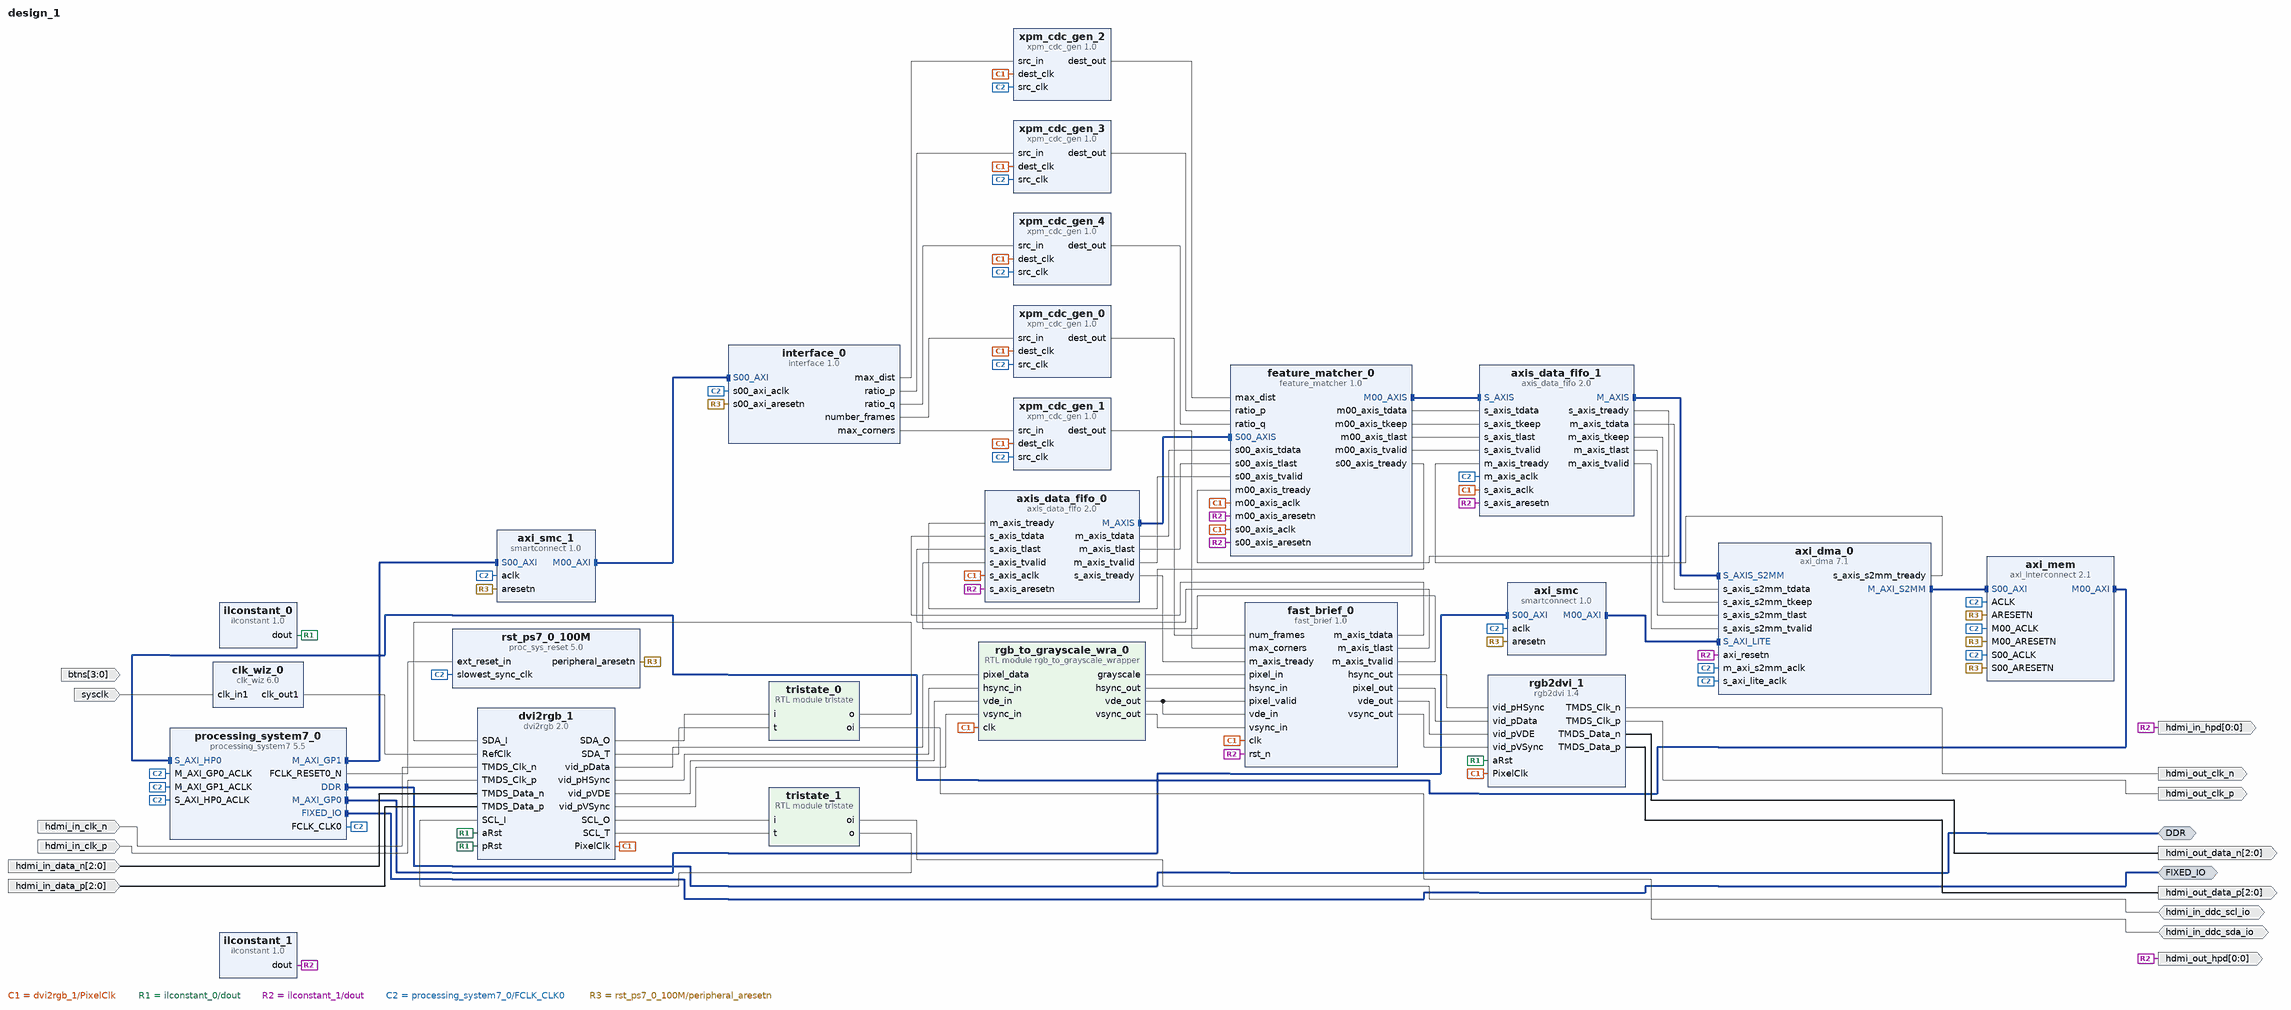
[diagram p0: block diagram of the top level]
# Vivado block design design_1, xc7z020clg400-1, Vivado 2025.1
create_bd_design design_1

create_bd_intf_port -mode Master -vlnv xilinx.com:interface:ddrx_rtl:1.0 DDR
create_bd_intf_port -mode Master -vlnv xilinx.com:display_processing_system7:fixedio_rtl:1.0 FIXED_IO
create_bd_port -dir I hdmi_in_clk_p
create_bd_port -dir I hdmi_in_clk_n
create_bd_port -dir I -from 2 -to 0 hdmi_in_data_n
create_bd_port -dir I -from 2 -to 0 hdmi_in_data_p
create_bd_port -dir I sysclk
create_bd_port -dir I -from 3 -to 0 btns
create_bd_port -dir O hdmi_out_clk_p
create_bd_port -dir O hdmi_out_clk_n
create_bd_port -dir O -from 2 -to 0 hdmi_out_data_p
create_bd_port -dir O -from 2 -to 0 hdmi_out_data_n
create_bd_port -dir O -from 0 -to 0 hdmi_in_hpd
create_bd_port -dir O -from 0 -to 0 hdmi_out_hpd
create_bd_port -dir IO hdmi_in_ddc_scl_io
create_bd_port -dir IO hdmi_in_ddc_sda_io

create_bd_cell -type ip -vlnv xilinx.com:ip:processing_system7:5.5 processing_system7_0
set_property -dict [list \
  CONFIG.PCW_APU_PERIPHERAL_FREQMHZ 650 \
  CONFIG.PCW_CRYSTAL_PERIPHERAL_FREQMHZ 50 \
  CONFIG.PCW_ENET0_PERIPHERAL_ENABLE 0 \
  CONFIG.PCW_FCLK_CLK0_BUF FALSE \
  CONFIG.PCW_FPGA0_PERIPHERAL_FREQMHZ 100 \
  CONFIG.PCW_FPGA1_PERIPHERAL_FREQMHZ 50 \
  CONFIG.PCW_GPIO_MIO_GPIO_ENABLE 1 \
  CONFIG.PCW_GPIO_MIO_GPIO_IO MIO \
  CONFIG.PCW_I2C_RESET_ENABLE 1 \
  CONFIG.PCW_IRQ_F2P_INTR 1 \
  CONFIG.PCW_PERIPHERAL_BOARD_PRESET part0 \
  CONFIG.PCW_PRESET_BANK1_VOLTAGE {LVCMOS 1.8V} \
  CONFIG.PCW_QSPI_PERIPHERAL_ENABLE 0 \
  CONFIG.PCW_SD0_PERIPHERAL_ENABLE 0 \
  CONFIG.PCW_UART1_PERIPHERAL_ENABLE 0 \
  CONFIG.PCW_UIPARAM_DDR_BUS_WIDTH {16 Bit} \
  CONFIG.PCW_UIPARAM_DDR_FREQ_MHZ 525 \
  CONFIG.PCW_UIPARAM_DDR_PARTNO {MT41J256M16 RE-125} \
  CONFIG.PCW_USB0_PERIPHERAL_ENABLE 0 \
  CONFIG.PCW_USB_RESET_ENABLE 1 \
  CONFIG.PCW_USE_FABRIC_INTERRUPT 1 \
  CONFIG.PCW_USE_M_AXI_GP1 1 \
  CONFIG.PCW_USE_S_AXI_HP0 1 \
  CONFIG.preset None \
] [get_bd_cells processing_system7_0]
# 489 more settings of processing_system7_0 are not shown: defaults, MIO pin electricals, DDR timing, and values the tool derives
create_bd_cell -type ip -vlnv xilinx.com:ip:clk_wiz:6.0 clk_wiz_0
set_property -dict [list \
  CONFIG.CLKIN1_JITTER_PS 80.0 \
  CONFIG.CLKOUT1_DRIVES BUFG \
  CONFIG.CLKOUT1_JITTER 109.241 \
  CONFIG.CLKOUT1_PHASE_ERROR 96.948 \
  CONFIG.CLKOUT1_REQUESTED_OUT_FREQ 200.000 \
  CONFIG.CLKOUT2_DRIVES BUFG \
  CONFIG.CLKOUT3_DRIVES BUFG \
  CONFIG.CLKOUT4_DRIVES BUFG \
  CONFIG.CLKOUT5_DRIVES BUFG \
  CONFIG.CLKOUT6_DRIVES BUFG \
  CONFIG.CLKOUT7_DRIVES BUFG \
  CONFIG.MMCM_BANDWIDTH OPTIMIZED \
  CONFIG.MMCM_CLKFBOUT_MULT_F 8 \
  CONFIG.MMCM_CLKIN1_PERIOD 8.000 \
  CONFIG.MMCM_CLKIN2_PERIOD 10.0 \
  CONFIG.MMCM_CLKOUT0_DIVIDE_F 5 \
  CONFIG.MMCM_COMPENSATION ZHOLD \
  CONFIG.MMCM_DIVCLK_DIVIDE 1 \
  CONFIG.PLL_CLKIN_PERIOD 8.000 \
  CONFIG.PRIMITIVE PLL \
  CONFIG.PRIM_IN_FREQ 125.000 \
  CONFIG.USE_LOCKED false \
  CONFIG.USE_RESET false \
] [get_bd_cells clk_wiz_0]
create_bd_cell -type module -reference tristate tristate_0
create_bd_cell -type module -reference tristate tristate_1
create_bd_cell -type inline_hdl -vlnv xilinx.com:inline_hdl:ilconstant:1.0 ilconstant_0
set_property -dict {CONFIG.CONST_VAL 0} [get_bd_cells ilconstant_0]
create_bd_cell -type inline_hdl -vlnv xilinx.com:inline_hdl:ilconstant:1.0 ilconstant_1
create_bd_cell -type module -reference rgb_to_grayscale_wrapper rgb_to_grayscale_wra_0
create_bd_cell -type ip -vlnv mit.edu:user:fast_brief:1.0 fast_brief_0
create_bd_cell -type ip -vlnv mit.edu:user:feature_matcher:1.0 feature_matcher_0
set_property -dict {CONFIG.IDX_SIZE 11 CONFIG.NUM_CORNERS 1024} [get_bd_cells feature_matcher_0]
create_bd_cell -type ip -vlnv xilinx.com:ip:axis_data_fifo:2.0 axis_data_fifo_0
set_property -dict {CONFIG.FIFO_DEPTH 4096 CONFIG.HAS_TLAST 1 CONFIG.TDATA_NUM_BYTES 35} [get_bd_cells axis_data_fifo_0]
create_bd_cell -type ip -vlnv xilinx.com:ip:axi_dma:7.1 axi_dma_0
set_property -dict [list \
  CONFIG.c_include_mm2s 0 \
  CONFIG.c_include_s2mm_dre 0 \
  CONFIG.c_include_sg 0 \
  CONFIG.c_micro_dma 0 \
  CONFIG.c_s_axis_s2mm_tdata_width 64 \
  CONFIG.c_sg_length_width 23 \
] [get_bd_cells axi_dma_0]
create_bd_cell -type ip -vlnv xilinx.com:ip:axi_interconnect:2.1 axi_mem
set_property -dict {CONFIG.NUM_MI 1} [get_bd_cells axi_mem]
create_bd_cell -type ip -vlnv xilinx.com:ip:proc_sys_reset:5.0 rst_ps7_0_100M
create_bd_cell -type ip -vlnv xilinx.com:ip:axis_data_fifo:2.0 axis_data_fifo_1
set_property -dict [list \
  CONFIG.FIFO_DEPTH 64 \
  CONFIG.HAS_TKEEP 1 \
  CONFIG.IS_ACLK_ASYNC 1 \
  CONFIG.TDATA_NUM_BYTES 8 \
] [get_bd_cells axis_data_fifo_1]
create_bd_cell -type ip -vlnv xilinx.com:ip:smartconnect:1.0 axi_smc
set_property -dict {CONFIG.NUM_SI 1} [get_bd_cells axi_smc]
create_bd_cell -type ip -vlnv digilentinc.com:ip:dvi2rgb:2.0 dvi2rgb_1
set_property -dict {CONFIG.kClkRange 3} [get_bd_cells dvi2rgb_1]
create_bd_cell -type ip -vlnv digilentinc.com:ip:rgb2dvi:1.4 rgb2dvi_1
set_property -dict {CONFIG.kClkPrimitive MMCM CONFIG.kClkRange 2} [get_bd_cells rgb2dvi_1]
create_bd_cell -type ip -vlnv xilinx.com:ip:xpm_cdc_gen:1.0 xpm_cdc_gen_0
set_property -dict {CONFIG.CDC_TYPE xpm_cdc_array_single CONFIG.WIDTH 8} [get_bd_cells xpm_cdc_gen_0]
create_bd_cell -type ip -vlnv user.org:user:interface:1.0 interface_0
create_bd_cell -type ip -vlnv xilinx.com:ip:xpm_cdc_gen:1.0 xpm_cdc_gen_1
set_property -dict {CONFIG.CDC_TYPE xpm_cdc_array_single CONFIG.WIDTH 16} [get_bd_cells xpm_cdc_gen_1]
create_bd_cell -type ip -vlnv xilinx.com:ip:xpm_cdc_gen:1.0 xpm_cdc_gen_2
set_property -dict {CONFIG.CDC_TYPE xpm_cdc_array_single CONFIG.WIDTH 16} [get_bd_cells xpm_cdc_gen_2]
create_bd_cell -type ip -vlnv xilinx.com:ip:xpm_cdc_gen:1.0 xpm_cdc_gen_3
set_property -dict {CONFIG.CDC_TYPE xpm_cdc_array_single CONFIG.WIDTH 16} [get_bd_cells xpm_cdc_gen_3]
create_bd_cell -type ip -vlnv xilinx.com:ip:xpm_cdc_gen:1.0 xpm_cdc_gen_4
set_property -dict {CONFIG.CDC_TYPE xpm_cdc_array_single CONFIG.WIDTH 16} [get_bd_cells xpm_cdc_gen_4]
create_bd_cell -type ip -vlnv xilinx.com:ip:smartconnect:1.0 axi_smc_1
set_property -dict {CONFIG.NUM_SI 1} [get_bd_cells axi_smc_1]

# ---- connections ----

connect_bd_intf_net [get_bd_intf_pins axi_dma_0/M_AXI_S2MM] [get_bd_intf_pins axi_mem/S00_AXI]
connect_bd_intf_net -intf_net axi_mem_intercon_M00_AXI [get_bd_intf_pins axi_mem/M00_AXI] [get_bd_intf_pins processing_system7_0/S_AXI_HP0]
connect_bd_intf_net [get_bd_intf_pins axi_smc_1/M00_AXI] [get_bd_intf_pins interface_0/S00_AXI]
connect_bd_intf_net [get_bd_intf_pins axi_smc/M00_AXI] [get_bd_intf_pins axi_dma_0/S_AXI_LITE]
connect_bd_intf_net [get_bd_intf_pins axis_data_fifo_0/M_AXIS] [get_bd_intf_pins feature_matcher_0/S00_AXIS]
connect_bd_intf_net [get_bd_intf_pins axis_data_fifo_1/M_AXIS] [get_bd_intf_pins axi_dma_0/S_AXIS_S2MM]
connect_bd_intf_net [get_bd_intf_pins feature_matcher_0/M00_AXIS] [get_bd_intf_pins axis_data_fifo_1/S_AXIS]
connect_bd_intf_net [get_bd_intf_ports DDR] [get_bd_intf_pins processing_system7_0/DDR]
connect_bd_intf_net [get_bd_intf_ports FIXED_IO] [get_bd_intf_pins processing_system7_0/FIXED_IO]
connect_bd_intf_net [get_bd_intf_pins processing_system7_0/M_AXI_GP0] [get_bd_intf_pins axi_smc/S00_AXI]
connect_bd_intf_net [get_bd_intf_pins processing_system7_0/M_AXI_GP1] [get_bd_intf_pins axi_smc_1/S00_AXI]
connect_bd_net [get_bd_ports hdmi_in_ddc_scl_io] [get_bd_pins tristate_1/oi]
connect_bd_net [get_bd_ports hdmi_in_ddc_sda_io] [get_bd_pins tristate_0/oi]
connect_bd_net [get_bd_pins axi_dma_0/s_axis_s2mm_tready] [get_bd_pins axis_data_fifo_1/m_axis_tready]
connect_bd_net [get_bd_pins axis_data_fifo_0/m_axis_tdata] [get_bd_pins feature_matcher_0/s00_axis_tdata]
connect_bd_net [get_bd_pins axis_data_fifo_0/m_axis_tlast] [get_bd_pins feature_matcher_0/s00_axis_tlast]
connect_bd_net [get_bd_pins axis_data_fifo_0/m_axis_tvalid] [get_bd_pins feature_matcher_0/s00_axis_tvalid]
connect_bd_net [get_bd_pins axis_data_fifo_0/s_axis_tready] [get_bd_pins fast_brief_0/m_axis_tready]
connect_bd_net [get_bd_pins axis_data_fifo_1/m_axis_tdata] [get_bd_pins axi_dma_0/s_axis_s2mm_tdata]
connect_bd_net [get_bd_pins axis_data_fifo_1/m_axis_tkeep] [get_bd_pins axi_dma_0/s_axis_s2mm_tkeep]
connect_bd_net [get_bd_pins axis_data_fifo_1/m_axis_tlast] [get_bd_pins axi_dma_0/s_axis_s2mm_tlast]
connect_bd_net [get_bd_pins axis_data_fifo_1/m_axis_tvalid] [get_bd_pins axi_dma_0/s_axis_s2mm_tvalid]
connect_bd_net [get_bd_pins axis_data_fifo_1/s_axis_tready] [get_bd_pins feature_matcher_0/m00_axis_tready]
connect_bd_net [get_bd_pins clk_wiz_0/clk_out1] [get_bd_pins dvi2rgb_1/RefClk]
connect_bd_net [get_bd_pins dvi2rgb_1/PixelClk] \
  [get_bd_pins rgb_to_grayscale_wra_0/clk] [get_bd_pins axis_data_fifo_0/s_axis_aclk] \
  [get_bd_pins axis_data_fifo_1/s_axis_aclk] [get_bd_pins rgb2dvi_1/PixelClk] [get_bd_pins xpm_cdc_gen_0/dest_clk] \
  [get_bd_pins feature_matcher_0/s00_axis_aclk] [get_bd_pins feature_matcher_0/m00_axis_aclk] \
  [get_bd_pins xpm_cdc_gen_1/dest_clk] [get_bd_pins xpm_cdc_gen_2/dest_clk] [get_bd_pins xpm_cdc_gen_3/dest_clk] \
  [get_bd_pins xpm_cdc_gen_4/dest_clk] [get_bd_pins fast_brief_0/clk]
connect_bd_net [get_bd_pins dvi2rgb_1/SCL_O] [get_bd_pins tristate_1/i]
connect_bd_net [get_bd_pins dvi2rgb_1/SCL_T] [get_bd_pins tristate_1/t]
connect_bd_net [get_bd_pins dvi2rgb_1/SDA_O] [get_bd_pins tristate_0/i]
connect_bd_net [get_bd_pins dvi2rgb_1/SDA_T] [get_bd_pins tristate_0/t]
connect_bd_net [get_bd_pins dvi2rgb_1/vid_pData] [get_bd_pins rgb_to_grayscale_wra_0/pixel_data]
connect_bd_net [get_bd_pins dvi2rgb_1/vid_pHSync] [get_bd_pins rgb_to_grayscale_wra_0/hsync_in]
connect_bd_net [get_bd_pins dvi2rgb_1/vid_pVDE] [get_bd_pins rgb_to_grayscale_wra_0/vde_in]
connect_bd_net [get_bd_pins dvi2rgb_1/vid_pVSync] [get_bd_pins rgb_to_grayscale_wra_0/vsync_in]
connect_bd_net [get_bd_pins fast_brief_0/hsync_out] [get_bd_pins rgb2dvi_1/vid_pHSync]
connect_bd_net [get_bd_pins fast_brief_0/m_axis_tdata] [get_bd_pins axis_data_fifo_0/s_axis_tdata]
connect_bd_net [get_bd_pins fast_brief_0/m_axis_tlast] [get_bd_pins axis_data_fifo_0/s_axis_tlast]
connect_bd_net [get_bd_pins fast_brief_0/m_axis_tvalid] [get_bd_pins axis_data_fifo_0/s_axis_tvalid]
connect_bd_net [get_bd_pins fast_brief_0/pixel_out] [get_bd_pins rgb2dvi_1/vid_pData]
connect_bd_net [get_bd_pins fast_brief_0/vde_out] [get_bd_pins rgb2dvi_1/vid_pVDE]
connect_bd_net [get_bd_pins fast_brief_0/vsync_out] [get_bd_pins rgb2dvi_1/vid_pVSync]
connect_bd_net [get_bd_pins feature_matcher_0/m00_axis_tdata] [get_bd_pins axis_data_fifo_1/s_axis_tdata]
connect_bd_net [get_bd_pins feature_matcher_0/m00_axis_tkeep] [get_bd_pins axis_data_fifo_1/s_axis_tkeep]
connect_bd_net [get_bd_pins feature_matcher_0/m00_axis_tlast] [get_bd_pins axis_data_fifo_1/s_axis_tlast]
connect_bd_net [get_bd_pins feature_matcher_0/m00_axis_tvalid] [get_bd_pins axis_data_fifo_1/s_axis_tvalid]
connect_bd_net [get_bd_pins feature_matcher_0/s00_axis_tready] [get_bd_pins axis_data_fifo_0/m_axis_tready]
connect_bd_net [get_bd_ports hdmi_in_clk_n] [get_bd_pins dvi2rgb_1/TMDS_Clk_n]
connect_bd_net [get_bd_ports hdmi_in_clk_p] [get_bd_pins dvi2rgb_1/TMDS_Clk_p]
connect_bd_net [get_bd_ports hdmi_in_data_n] [get_bd_pins dvi2rgb_1/TMDS_Data_n]
connect_bd_net [get_bd_ports hdmi_in_data_p] [get_bd_pins dvi2rgb_1/TMDS_Data_p]
connect_bd_net [get_bd_pins ilconstant_0/dout] [get_bd_pins dvi2rgb_1/pRst] [get_bd_pins dvi2rgb_1/aRst] [get_bd_pins rgb2dvi_1/aRst]
connect_bd_net [get_bd_pins ilconstant_1/dout] \
  [get_bd_ports hdmi_out_hpd] [get_bd_ports hdmi_in_hpd] [get_bd_pins axis_data_fifo_0/s_axis_aresetn] \
  [get_bd_pins axi_dma_0/axi_resetn] [get_bd_pins axis_data_fifo_1/s_axis_aresetn] \
  [get_bd_pins feature_matcher_0/s00_axis_aresetn] [get_bd_pins feature_matcher_0/m00_axis_aresetn] \
  [get_bd_pins fast_brief_0/rst_n]
connect_bd_net [get_bd_pins interface_0/max_corners] [get_bd_pins xpm_cdc_gen_1/src_in]
connect_bd_net [get_bd_pins interface_0/max_dist] [get_bd_pins xpm_cdc_gen_2/src_in]
connect_bd_net [get_bd_pins interface_0/number_frames] [get_bd_pins xpm_cdc_gen_0/src_in]
connect_bd_net [get_bd_pins interface_0/ratio_p] [get_bd_pins xpm_cdc_gen_3/src_in]
connect_bd_net [get_bd_pins interface_0/ratio_q] [get_bd_pins xpm_cdc_gen_4/src_in]
connect_bd_net [get_bd_pins processing_system7_0/FCLK_CLK0] \
  [get_bd_pins axi_dma_0/m_axi_s2mm_aclk] [get_bd_pins axi_mem/S00_ACLK] [get_bd_pins rst_ps7_0_100M/slowest_sync_clk] \
  [get_bd_pins processing_system7_0/S_AXI_HP0_ACLK] [get_bd_pins axi_mem/M00_ACLK] [get_bd_pins axi_mem/ACLK] \
  [get_bd_pins axis_data_fifo_1/m_axis_aclk] [get_bd_pins axi_dma_0/s_axi_lite_aclk] [get_bd_pins axi_smc/aclk] \
  [get_bd_pins processing_system7_0/M_AXI_GP0_ACLK] [get_bd_pins processing_system7_0/M_AXI_GP1_ACLK] \
  [get_bd_pins xpm_cdc_gen_0/src_clk] [get_bd_pins interface_0/s00_axi_aclk] [get_bd_pins xpm_cdc_gen_1/src_clk] \
  [get_bd_pins xpm_cdc_gen_2/src_clk] [get_bd_pins xpm_cdc_gen_3/src_clk] [get_bd_pins xpm_cdc_gen_4/src_clk] \
  [get_bd_pins axi_smc_1/aclk]
connect_bd_net [get_bd_pins processing_system7_0/FCLK_RESET0_N] [get_bd_pins rst_ps7_0_100M/ext_reset_in]
connect_bd_net [get_bd_pins rgb2dvi_1/TMDS_Clk_n] [get_bd_ports hdmi_out_clk_n]
connect_bd_net [get_bd_pins rgb2dvi_1/TMDS_Clk_p] [get_bd_ports hdmi_out_clk_p]
connect_bd_net [get_bd_pins rgb2dvi_1/TMDS_Data_n] [get_bd_ports hdmi_out_data_n]
connect_bd_net [get_bd_pins rgb2dvi_1/TMDS_Data_p] [get_bd_ports hdmi_out_data_p]
connect_bd_net [get_bd_pins rgb_to_grayscale_wra_0/grayscale] [get_bd_pins fast_brief_0/pixel_in]
connect_bd_net [get_bd_pins rgb_to_grayscale_wra_0/hsync_out] [get_bd_pins fast_brief_0/hsync_in]
connect_bd_net [get_bd_pins rgb_to_grayscale_wra_0/vde_out] [get_bd_pins fast_brief_0/pixel_valid] [get_bd_pins fast_brief_0/vde_in]
connect_bd_net [get_bd_pins rgb_to_grayscale_wra_0/vsync_out] [get_bd_pins fast_brief_0/vsync_in]
connect_bd_net [get_bd_pins rst_ps7_0_100M/peripheral_aresetn] \
  [get_bd_pins axi_mem/S00_ARESETN] [get_bd_pins axi_mem/M00_ARESETN] [get_bd_pins axi_mem/ARESETN] \
  [get_bd_pins axi_smc/aresetn] [get_bd_pins interface_0/s00_axi_aresetn] [get_bd_pins axi_smc_1/aresetn]
connect_bd_net [get_bd_ports sysclk] [get_bd_pins clk_wiz_0/clk_in1]
connect_bd_net [get_bd_pins tristate_0/o] [get_bd_pins dvi2rgb_1/SDA_I]
connect_bd_net [get_bd_pins tristate_1/o] [get_bd_pins dvi2rgb_1/SCL_I]
connect_bd_net [get_bd_pins xpm_cdc_gen_0/dest_out] [get_bd_pins fast_brief_0/num_frames]
connect_bd_net [get_bd_pins xpm_cdc_gen_1/dest_out] [get_bd_pins fast_brief_0/max_corners]
connect_bd_net [get_bd_pins xpm_cdc_gen_2/dest_out] [get_bd_pins feature_matcher_0/max_dist]
connect_bd_net [get_bd_pins xpm_cdc_gen_3/dest_out] [get_bd_pins feature_matcher_0/ratio_p]
connect_bd_net [get_bd_pins xpm_cdc_gen_4/dest_out] [get_bd_pins feature_matcher_0/ratio_q]

# ---- address map ----
assign_bd_address -offset 0x00000000 -range 512M -target_address_space [get_bd_addr_spaces axi_dma_0/Data_S2MM] [get_bd_addr_segs processing_system7_0/S_AXI_HP0/HP0_DDR_LOWOCM]
assign_bd_address -offset 0x40400000 -range 64K -target_address_space [get_bd_addr_spaces processing_system7_0/Data] [get_bd_addr_segs axi_dma_0/S_AXI_LITE/Reg]
assign_bd_address -offset 0x83C00000 -range 64K -target_address_space [get_bd_addr_spaces processing_system7_0/Data] [get_bd_addr_segs interface_0/S00_AXI/S00_AXI_reg]

validate_bd_design
save_bd_design
